# EAGLE design 5V Dual Power Supply (EAGLE 9.5.2)
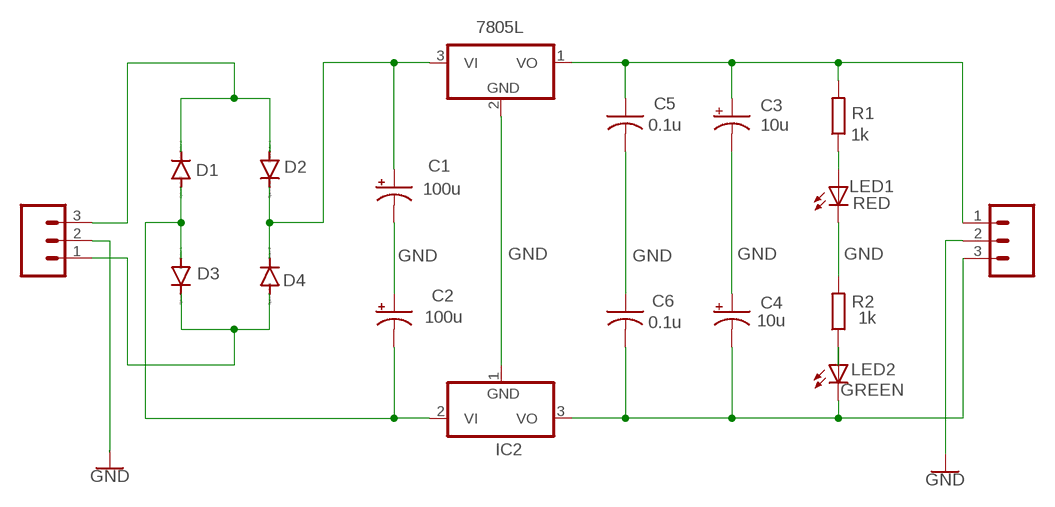
[diagram p0: schematic, sheet 1]

## Parts
C1  100u  CPOL-USE2-4  [E2-4]
C2  100u  CPOL-USE2-4  [E2-4]
C3  10u  CPOL-USE2-4  [E2-4]
C4  10u  CPOL-USE2-4  [E2-4]
C5  0.1u  C-US025-025X050  [C025-025X050]
C6  0.1u  C-US025-025X050  [C025-025X050]
D1  1N4004  [DO41-10]
D2  1N4004  [DO41-10]
D3  1N4004  [DO41-10]
D4  1N4004  [DO41-10]
IC1  7805L  [TO92]
IC2  7905L  [TO92]
J1  CONN_03-SCREW-5MM  [SCREWTERMINAL-5MM-3]
J4  CONN_03-SCREW-5MM  [SCREWTERMINAL-5MM-3]
LED1  RED  LED5MM  [LED5MM]
LED2  GREEN  LED5MM  [LED5MM]
R1  1k  R-EU_0204/7  [0204/7]
R2  1k  R-EU_0204/7  [0204/7]

## Nets
GND: C1.- C2.+ C3.- C4.+ C5.2 C6.1 IC1.2(GND) IC2.1(GND) J1.2 J4.2 LED1.K(C) R2.2
N$1: D1.C D2.A J1.3
N$2: C1.+ D2.C D4.C IC1.3(VI)
N$4: D3.C D4.A J1.1
N$6: C3.+ C5.1 IC1.1(VO) J4.1 R1.2
N$8: C4.- C6.2 IC2.3(VO) J4.3 LED2.K(C)
N$12: LED1.A R1.1
N$13: LED2.A R2.1
N$15: C2.- D1.A D3.A IC2.2(VI)

## Library data of the parts
C1-C4 = adafruit:CPOL-US: POLARIZED CAPACITOR, American symbol
C5 C6 = adafruit:C-US: CAPACITOR, American symbol
D1-D4 = diode:1N4004: DIODE general purpose rectifier, 1 A
IC1 = linear:78*: Positive VOLTAGE REGULATOR Source: http://cache.national.com/ds/LM/LM78L05.pdf http://www.fairchildsemi.com/ds/LM/LM7805.pdf
IC2 = linear:79*: Negative VOLTAGE REGULATOR
J1 J4 = SparkFun-Connectors:CONN_03: Multi connection point. Often used as Generic Header-pin footprint for 0.1 inch spaced/style header connections On any of the 0.1 inch spaced packages, you can populate with these: Break Away Headers - Straight <https://www.sparkfun.com/products/116> (PRT-00116) Break Away Male Headers - Right Angle <https://www.sparkfun.com/products/553> (PRT-00553) Female Headers <https://www.sparkfun.com/products/115> (PRT-00115) Break Away Headers - Machine Pin <https://www.sparkfun.com/products/117> (PRT-00117) Break Away Female Headers - Swiss Machine Pin <https://www.sparkfun.com/products/743> (PRT-00743) Stackable Header - 3 Pin (Female, 0.1") <https://www.sparkfun.com/products/13875> (PRT-13875) For SCREWTERMINALS and SPRING TERMINALS visit here: Screw Terimnals on SparkFun.com <https://www.sparkfun.com/search/results?term=Screw+Terminals> (5mm/3.5mm/2.54mm spacing) This device is also useful as a general connection point to wire up your design to another part of your project. Our various solder wires solder well into these plated through hole pads. Hook-Up Wire - Assortment (Stranded, 22 AWG) <https://www.sparkfun.com/products/11375> (PRT-11375) Hook-Up Wire - Assortment (Solid Core, 22 AWG) <https://www.sparkfun.com/products/11367> (PRT-11367) View the entire wire category on our website here <https://www.sparkfun.com/categories/141> Special notes: Molex polarized connector foot print use with SKU : PRT-08232 with associated crimp pins and housings.; PROD_ID: CONN-10134; SF_SKU: PRT-08433
LED1 LED2 = adafruit:LED: LED OSRAM: - CHIPLED LG R971, LG N971, LY N971, LG Q971, LY Q971, LO R971, LY R971 LH N974, LH R974 LS Q976, LO Q976, LY Q976 LO Q996 - Hyper CHIPLED LW Q18S LB Q993, LB Q99A, LB R99A - SideLED LS A670, LO A670, LY A670, LG A670, LP A670 LB A673, LV A673, LT A673, LW A673 LH A674 LY A675 LS A676, LA A676, LO A676, LY A676, LW A676 LS A679, LY A679, LG A679 - Hyper Micro SIDELED® LS Y876, LA Y876, LO Y876, LY Y876 LT Y87S - SmartLED LW L88C, LW L88S LB L89C, LB L89S, LG L890 LS L89K, LO L89K, LY L89K LS L896, LA L896, LO L896, LY L896 - TOPLED LS T670, LO T670, LY T670, LG T670, LP T670 LSG T670, LSP T670, LSY T670, LOP T670, LYG T670 LG T671, LOG T671, LSG T671 LB T673, LV T673, LT T673, LW T673 LH T674 LS T676, LA T676, LO T676, LY T676, LB T676, LH T676, LSB T676, LW T676 LB T67C, LV T67C, LT T67C, LS T67K, LO T67K, LY T67K, LW E67C LS E67B, LA E67B, LO E67B, LY E67B, LB E67C, LV E67C, LT E67C LW T67C LS T679, LY T679, LG T679 LS T770, LO T770, LY T770, LG T770, LP T770 LB T773, LV T773, LT T773, LW T773 LH T774 LS E675, LA E675, LY E675, LS T675 LS T776, LA T776, LO T776, LY T776, LB T776 LHGB T686 LT T68C, LB T68C - Hyper Mini TOPLED® LB M676 - Mini TOPLED Santana® LG M470 LS M47K, LO M47K, LY M47K Source: http://www.osram.convergy.de/
R1 R2 = rcl:R-EU_: RESISTOR, European symbol; SPICEPREFIX: R

## Board
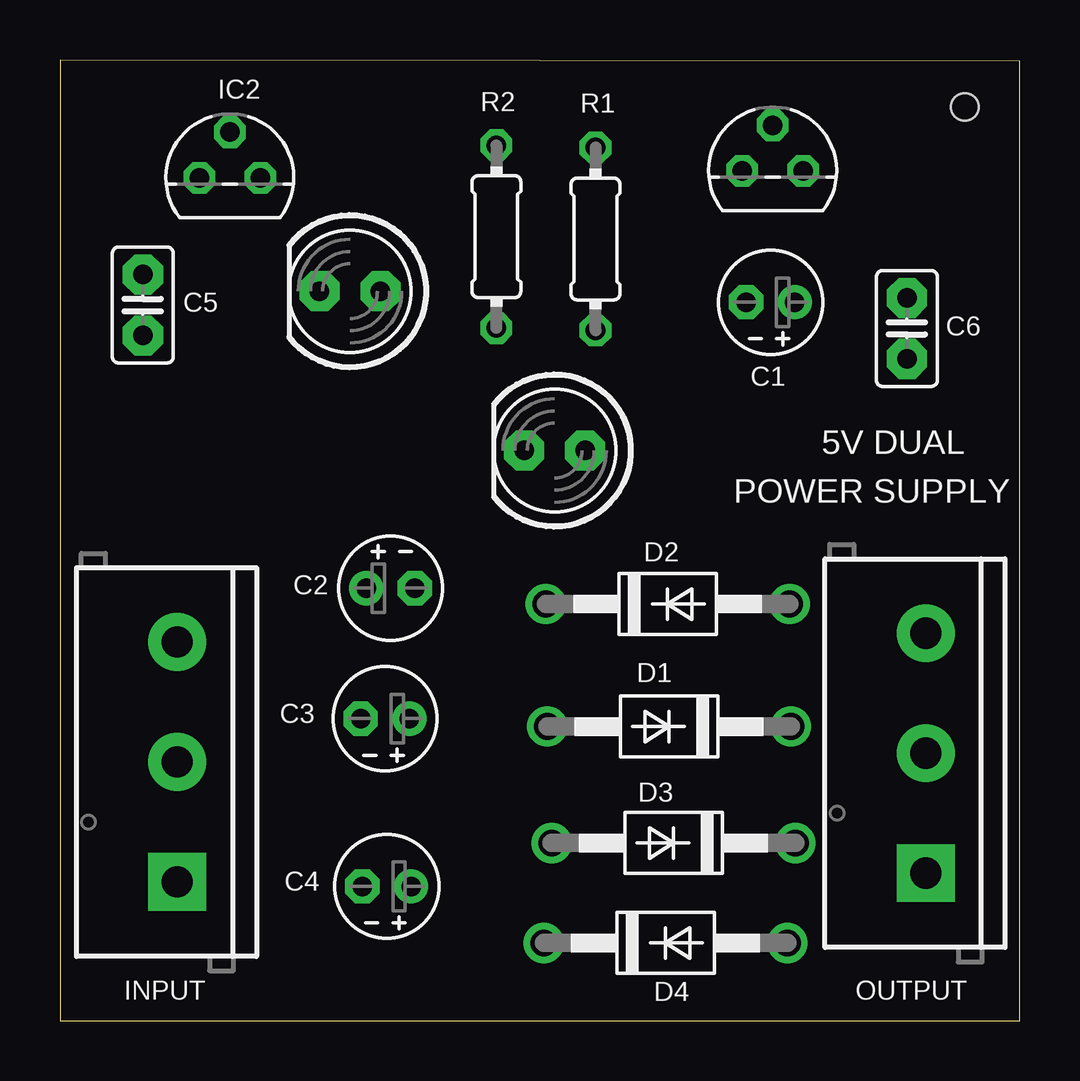
[diagram p1: board, top side]
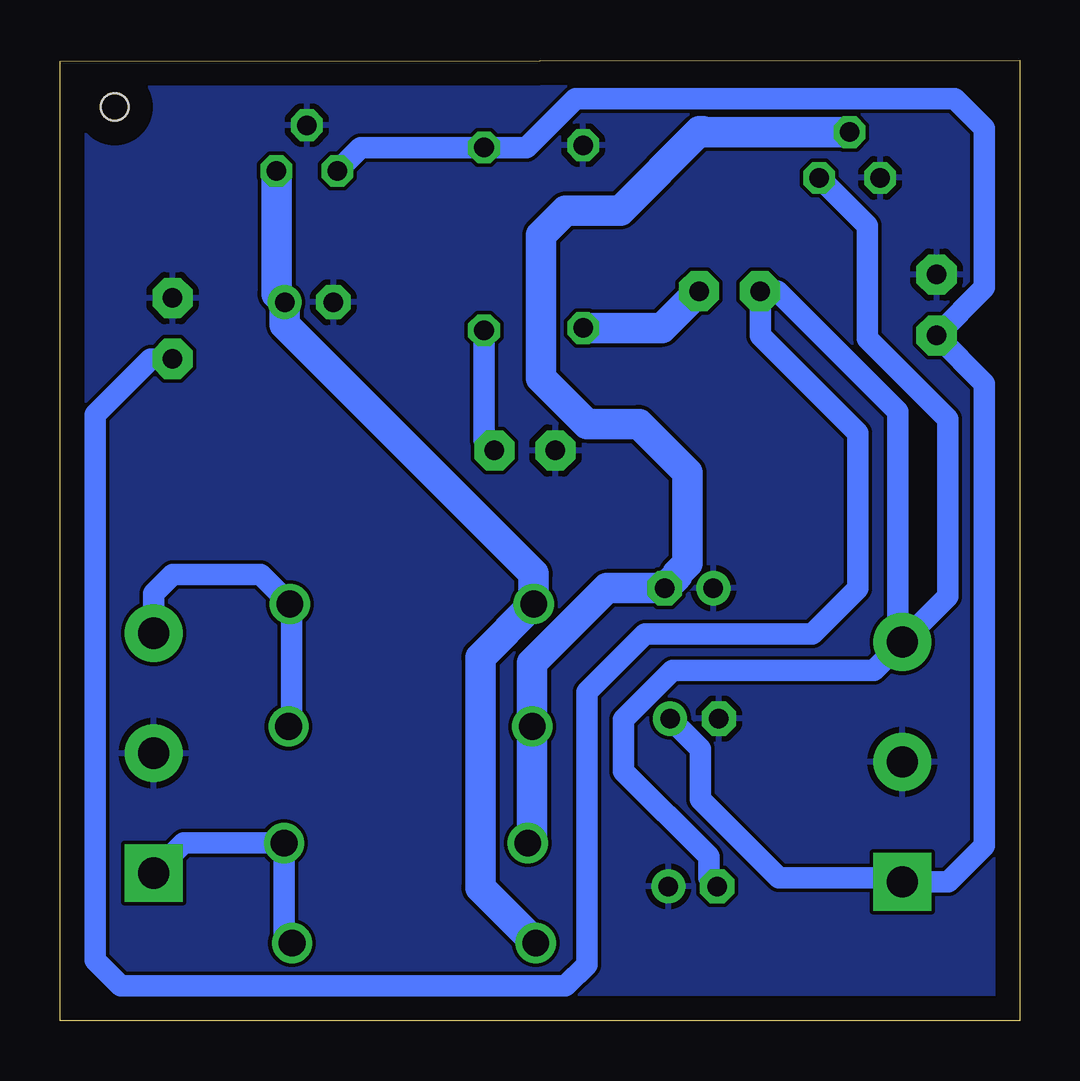
[diagram p2: board, bottom side, seen from below]

Size 40 x 40.06 mm. Coordinates in mm from the lower left corner, seen from the top.
Outline: 0,0 40,0 40,40 0,40.06 0,0
Copper layers (1*16): Top 0.035mm / dielectric 1.5mm / Bottom 0.035mm
Design rules "default": minimum track width 6mil, minimum drill 0.35mm, track to track 6mil, track to pad 6mil, pad to pad 6mil, via to via 6mil, smd to smd 6mil, copper to edge 40mil, drill to drill 6mil, minimum pad ring 10mil, minimum via ring 8mil, stop-mask expansion 4mil, vias tented up to drill 0mil, thermal gap 10mil
Holes 1.14 mm at 37.72,38.1

### Footprints (pad centres in the part's own frame; a part is rotated, then mirrored left to right if it is on the bottom)
E2-4 = drill 0.813 pad 1.422: + -1.016,0 | drill 0.813 pad 1.422 octagon: - 1.016,0
C025-025X050 = drill 0.813 pad 1.676 octagon: 1 -1.27,0; 2 1.27,0
DO41-10 = drill 1.118: A 5.08,0; C -5.08,0
TO92 = drill 0.813 octagon: 1 -1.27,0; 2 0,1.905; 3 1.27,0
SCREWTERMINAL-5MM-3 = drill 1.3 pad 2.413 square: 1 0,0 | drill 1.3 pad 2.413: 2 5,0; 3 10,0
LED5MM = drill 0.813 pad 1.676 octagon: A -1.27,0; K 1.27,0
0204/7 = drill 0.813 octagon: 1 -3.81,0; 2 3.81,0

### Placement (x,y rotation side)
C1  29.62,29.96 180 top
C2  13.78,18.04 0 top
C3  13.55,12.6 180 top
C4  13.62,5.61 180 top
C5  3.45,29.84 90 top
C6  35.31,28.87 270 top
D1  25.39,12.27 180 top
D2  25.33,17.38 0 top
D3  25.58,7.42 180 top
D4  25.25,3.25 0 top
IC1  29.71,35.43 0 top
IC2  7.08,35.15 0 top
J1  36.09,6.16 90 top
J4  4.89,5.79 90 top
LED1  20.62,23.78 180 top
LED2  12.09,30.42 180 top
R1  22.32,32.6 90 top
R2  18.19,32.7 90 top

### Tracks (layer width: path | path; a pad name or v marks a point on that pad's centre or on a via)
GND
  pour Bottom: 0,39.37 0,0 1.27,0 39.37,0 40.64,0 40.64,40.64 0,40.64
N$1
  Bottom 0.889: D1.C 30.35,12.4 30.35,17.32 D2.A 31.64,18.61 35.3,18.61 36.09,17.81 J1.3
N$2
  Bottom 1.27: D4.C 22.48,5.56 22.48,15.15 D2.C 20.25,18.65 30.64,29.03 C1.+ 30.98,30.3 IC1.3
N$4
  Bottom 0.889: J1.1 34.84,7.42 D3.C 30.66,3.58 D4.A
N$6
  Bottom 0.889: C3.+ 13.3,11.33 13.3,9.23 10.03,5.97 5.06,5.97 J4.1 2.97,5.79 1.46,7.3 1.46,26.58 C5.1 1.46,30.57 1.46,37.21 2.69,38.44 18.51,38.44 20.55,36.41 R1.2 27.46,36.41 IC1.1
N$8
  Bottom 0.889: J4.3 6.08,14.61 14.48,14.61 16.51,12.57 16.51,10.41 12.95,6.86 12.95,5.96 C4.- | J4.3 2.98,17.7 2.98,25.08 6.35,28.45 6.35,33.14 IC2.3 | J4.3 5.08,15.98 5.08,25.4 10.1,30.42 LED2.K 10.79,30.4 10.79,28.57 6.73,24.51 6.73,18.03 8.64,16.13 15.62,16.13 18.03,13.72 18.03,2.35 18.92,1.46 37.47,1.46 38.54,2.54 38.54,25.27 36.22,27.6 C6.2
N$12
  Bottom 0.889: R1.1 22.32,24.21 LED1.A
N$13
  Bottom 1.27: R2.1 14.9,28.89 LED2.A
N$15
  Bottom 1.27: D3.A 20.31,7.6 D1.A 20.31,14.93 17.21,18.04 C2.- 14.26,18.57 14.26,18.66 13.84,19.08 13.84,22.86 15.88,24.89 18.03,24.89 19.94,26.8 19.94,32.77 18.92,33.78 16.64,33.78 13.34,37.08 13.21,37.08 13.17,37.05 IC2.2

### Text on the board
tNames: 5V DUAL | POWER SUPPLY | INPUT | OUTPUT